# EAGLE design rc2014_spi (EAGLE 7.6.0)
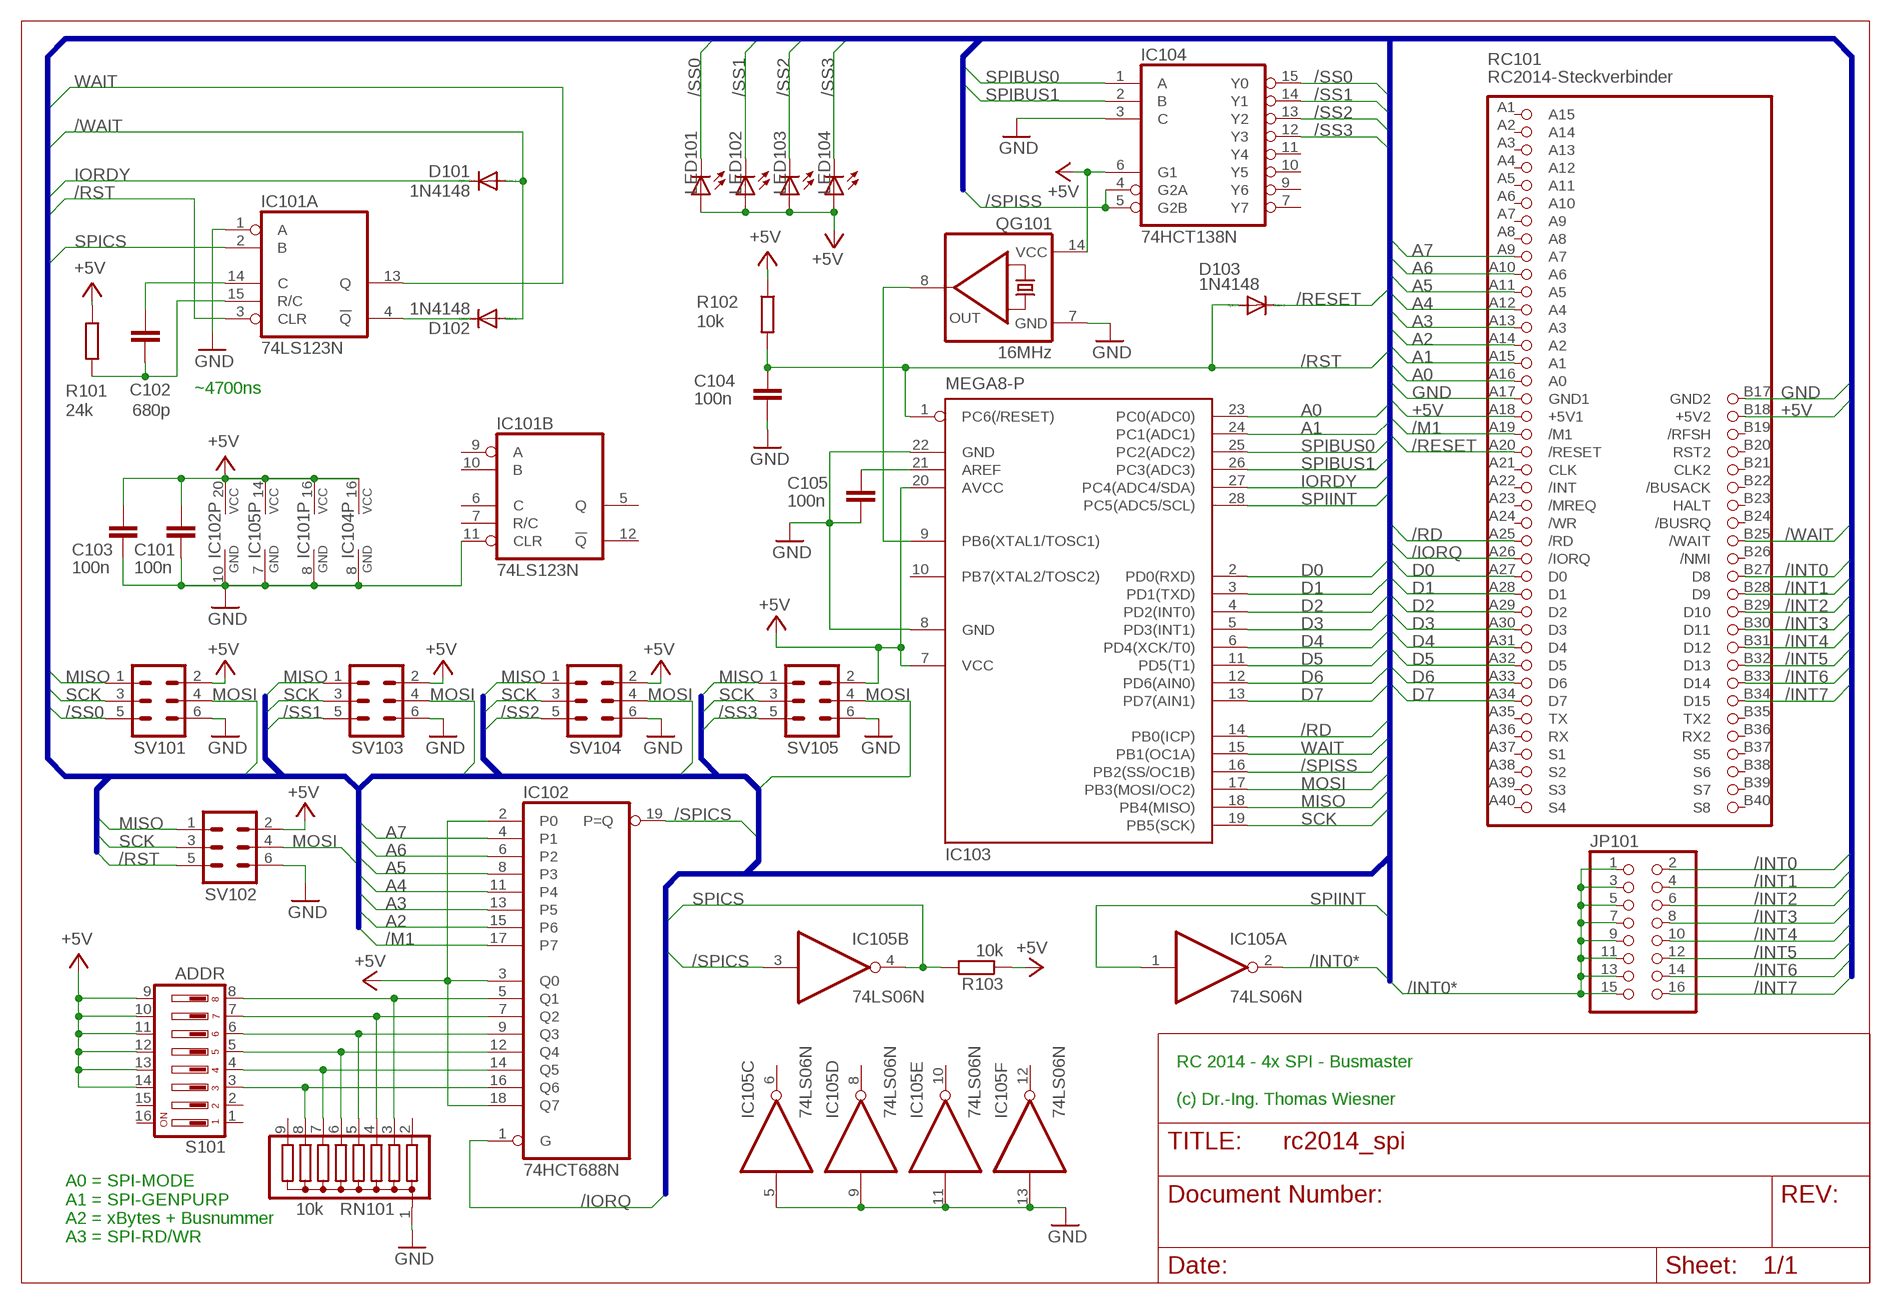
[diagram p0: schematic, sheet 1]

## Parts
C101  100n  C-EU025-025X050  [C025-025X050]
C102  680p  C-EU025-025X050  [C025-025X050]
C103  100n  C-EU025-025X050  [C025-025X050]
C104  100n  C-EU025-025X050  [C025-025X050]
C105  100n  C-EU025-025X050  [C025-025X050]
D101  1N4148  1N4148DO35-10  [DO35-10]
D102  1N4148  1N4148DO35-10  [DO35-10]
D103  1N4148  1N4148DO35-10  [DO35-10]
IC101  74LS123N  [DIL16]
IC102  74HCT688N  [DIL20]
IC103  MEGA8-P  [DIL28-3]
IC104  74HCT138N  [DIL16]
IC105  74LS06N  [DIL14]
JP101  PINHD-2X8  [2X08]
LED101  LED3MM  [LED3MM]
LED102  LED3MM  [LED3MM]
LED103  LED3MM  [LED3MM]
LED104  LED3MM  [LED3MM]
QG101  16MHz  QG5860  [DIL14S]
R101  24k  R-EU_0207/10  [0207/10]
R102  10k  R-EU_0207/10  [0207/10]
R103  10k  R-EU_0207/10  [0207/10]
RC101  RC2014-Steckverbinder  RC2014STECKER  [RC2014-STECKER]
RN101  10k  G08R  [SIL9]
S101  ADDR  DS08  [DS-08]
SV101  ML6L  [ML6L]
SV102  ML6L  [ML6L]
SV103  ML6L  [ML6L]
SV104  ML6L  [ML6L]
SV105  ML6L  [ML6L]

## Nets
+5V: C101.2 C103.2 IC101.16(P:VCC) IC102.2(P0) IC102.3(Q0) IC102.18(Q7) IC102.20(VCC) IC103.7(VCC) IC103.20(AVCC) IC104.6(G1) IC104.16(VCC) IC105.14(P:VCC) LED101.A LED102.A LED103.A LED104.A QG101.14(VCC) R101.1 R102.1 R103.1 RC101.A18(+5V1) RC101.B18(+5V2) S101.9 S101.10 S101.11 S101.12 S101.13 S101.14 SV101.2 SV102.2 SV103.2 SV104.2 SV105.2
/INT0: JP101.2 RC101.B27(D8)
/INT0*: IC105.2(A:O) JP101.1 JP101.3 JP101.5 JP101.7 JP101.9 JP101.11 JP101.13 JP101.15
/INT1: JP101.4 RC101.B28(D9)
/INT2: JP101.6 RC101.B29(D10)
/INT3: JP101.8 RC101.B30(D11)
/INT4: JP101.10 RC101.B31(D12)
/INT5: JP101.12 RC101.B32(D13)
/INT6: JP101.14 RC101.B33(D14)
/INT7: JP101.16 RC101.B34(D15)
/IORQ: IC102.1(G) RC101.A26(/IORQ)
/M1: IC102.17(P7) RC101.A19(/M1)
/RD: IC103.14(PB0(ICP)) RC101.A25(/RD)
/RESET: D103.C RC101.A20(/RESET)
/RST: C104.2 D103.A IC101.3(A:CLR) IC103.1(PC6(/RESET)) R102.2 SV102.5
/SPICS: IC102.19(P=Q) IC105.3(B:I)
/SPISS: IC103.16(PB2(SS/OC1B)) IC104.4(G2A) IC104.5(G2B)
/SS0: IC104.15(Y0) LED101.K(C) SV101.5
/SS1: IC104.14(Y1) LED102.K(C) SV103.5
/SS2: IC104.13(Y2) LED103.K(C) SV104.5
/SS3: IC104.12(Y3) LED104.K(C) SV105.5
/WAIT: D101.A D102.A RC101.B25(/WAIT)
A0: IC103.23(PC0(ADC0)) RC101.A16(A0)
A1: IC103.24(PC1(ADC1)) RC101.A15(A1)
A2: IC102.15(P6) RC101.A14(A2)
A3: IC102.13(P5) RC101.A13(A3)
A4: IC102.11(P4) RC101.A12(A4)
A5: IC102.8(P3) RC101.A11(A5)
A6: IC102.6(P2) RC101.A10(A6)
A7: IC102.4(P1) RC101.A9(A7)
D0: IC103.2(PD0(RXD)) RC101.A27(D0)
D1: IC103.3(PD1(TXD)) RC101.A28(D1)
D2: IC103.4(PD2(INT0)) RC101.A29(D2)
D3: IC103.5(PD3(INT1)) RC101.A30(D3)
D4: IC103.6(PD4(XCK/T0)) RC101.A31(D4)
D5: IC103.11(PD5(T1)) RC101.A32(D5)
D6: IC103.12(PD6(AIN0)) RC101.A33(D6)
D7: IC103.13(PD7(AIN1)) RC101.A34(D7)
GND: C101.1 C103.1 C104.1 C105.1 IC101.1(A:A) IC101.8(P:GND) IC101.11(B:CLR) IC102.10(GND) IC103.8(GND) IC103.22(GND) IC104.3(C) IC104.8(GND) IC105.5(C:I) IC105.7(P:GND) IC105.9(D:I) IC105.11(E:I) IC105.13(F:I) QG101.7(GND) RC101.A17(GND1) RC101.B17(GND2) RN101.1 SV101.6 SV102.6 SV103.6 SV104.6 SV105.6
IORDY: D101.C IC103.27(PC4(ADC4/SDA))
MISO: IC103.18(PB4(MISO)) SV101.1 SV102.1 SV103.1 SV104.1 SV105.1
MOSI: IC103.17(PB3(MOSI/OC2)) SV101.4 SV102.4 SV103.4 SV104.4 SV105.4
N$1: C102.1 IC101.15(A:R/C) R101.2
N$2: D102.C IC101.4(A:!Q)
N$3: C105.2 IC103.21(AREF)
N$4: C102.2 IC101.14(A:C)
N$6: IC102.16(Q6) RN101.8 S101.3
N$7: IC102.14(Q5) RN101.7 S101.4
N$8: IC102.12(Q4) RN101.6 S101.5
N$9: IC102.9(Q3) RN101.5 S101.6
N$10: IC102.7(Q2) RN101.4 S101.7
N$11: IC102.5(Q1) RN101.3 S101.8
QUARZ: IC103.9(PB6(XTAL1/TOSC1)) QG101.8(OUT)
SCK: IC103.19(PB5(SCK)) SV101.3 SV102.3 SV103.3 SV104.3 SV105.3
SPIBUS0: IC103.25(PC2(ADC2)) IC104.1(A)
SPIBUS1: IC103.26(PC3(ADC3)) IC104.2(B)
SPICS: IC101.2(A:B) IC105.4(B:O) R103.2
SPIINT: IC103.28(PC5(ADC5/SCL)) IC105.1(A:I)
WAIT: IC101.13(A:Q) IC103.15(PB1(OC1A))
Unconnected: IC101.5(B:Q) IC101.6(B:C) IC101.7(B:R/C) IC101.9(B:A) IC101.10(B:B) IC101.12(B:!Q) IC103.10(PB7(XTAL2/TOSC2)) IC104.7(Y7) IC104.9(Y6) IC104.10(Y5) IC104.11(Y4) IC105.6(C:O) IC105.8(D:O) IC105.10(E:O) IC105.12(F:O) RC101.A1(A15) RC101.A2(A14) RC101.A3(A13) RC101.A4(A12) RC101.A5(A11) RC101.A6(A10) RC101.A7(A9) RC101.A8 RC101.A21(CLK) RC101.A22(/INT) RC101.A23(/MREQ) RC101.A24(/WR) RC101.A35(TX) RC101.A36(RX) RC101.A37(S1) RC101.A38(S2) RC101.A39(S3) RC101.A40(S4) RC101.B19(/RFSH) RC101.B20(RST2) RC101.B21(CLK2) RC101.B22(/BUSACK) RC101.B23(HALT) RC101.B24(/BUSRQ) RC101.B26(/NMI) RC101.B35(TX2) RC101.B36(RX2) RC101.B37(S5) RC101.B38(S6) RC101.B39(S7) RC101.B40(S8) RN101.2 RN101.9 S101.1 S101.2 S101.15 S101.16

## Buses
B$1
B$2

## Notes on the sheet
- ~4700ns
- RC 2014 - 4x SPI - Busmaster
  
  (c) Dr.-Ing. Thomas Wiesner
- A0 = SPI-MODE
  A1 = SPI-GENPURP
  A2 = xBytes + Busnummer
  A3 = SPI-RD/WR

## Library data of the parts
C101-C105 = rcl:C-EU: CAPACITOR, European symbol
D101-D103 = diode:1N4148: DIODE high speed (Philips)
IC101 = 74xx-eu:74*123: Retriggerable monostable MULTIVIBRATOR
IC102 = 74xx-eu:74*688: 8-bit MAGNITUDE/IDENTITY COMPARATOR, totem pole
IC103 = atmel:MEGA8-P: MICROCONTROLLER 8 Kbytes FLASH, 1 kbytes SRAM, 512 bytes EEPROM, USART, 4-channel 10 bit ADC, 2-channel 8 bit ADC Pin compatible with Atmega48, ATMega88, ATMega168 Source: avr.lbr; OC_FARNELL: unknown; OC_NEWARK: unknown
IC104 = 74xx-eu:74*138: 3-line to 8-line DECODER/DEMULTIPLEXER
IC105 = 74xx-eu:74*06: Hex INVERTER, open collector high-voltage output
JP101 = pinhead:PINHD-2X8: PIN HEADER
LED101-LED104 = led:LED: LED OSRAM: - CHIPLED LG R971, LG N971, LY N971, LG Q971, LY Q971, LO R971, LY R971 LH N974, LH R974 LS Q976, LO Q976, LY Q976 LO Q996 - Hyper CHIPLED LW Q18S LB Q993, LB Q99A, LB R99A - SideLED LS A670, LO A670, LY A670, LG A670, LP A670 LB A673, LV A673, LT A673, LW A673 LH A674 LY A675 LS A676, LA A676, LO A676, LY A676, LW A676 LS A679, LY A679, LG A679 - Hyper Micro SIDELED® LS Y876, LA Y876, LO Y876, LY Y876 LT Y87S - SmartLED LW L88C, LW L88S LB L89C, LB L89S, LG L890 LS L89K, LO L89K, LY L89K LS L896, LA L896, LO L896, LY L896 - TOPLED LS T670, LO T670, LY T670, LG T670, LP T670 LSG T670, LSP T670, LSY T670, LOP T670, LYG T670 LG T671, LOG T671, LSG T671 LB T673, LV T673, LT T673, LW T673 LH T674 LS T676, LA T676, LO T676, LY T676, LB T676, LH T676, LSB T676, LW T676 LB T67C, LV T67C, LT T67C, LS T67K, LO T67K, LY T67K, LW E67C LS E67B, LA E67B, LO E67B, LY E67B, LB E67C, LV E67C, LT E67C LW T67C LS T679, LY T679, LG T679 LS T770, LO T770, LY T770, LG T770, LP T770 LB T773, LV T773, LT T773, LW T773 LH T774 LS E675, LA E675, LY E675, LS T675 LS T776, LA T776, LO T776, LY T776, LB T776 LHGB T686 LT T68C, LB T68C - Hyper Mini TOPLED® LB M676 - Mini TOPLED Santana® LG M470 LS M47K, LO M47K, LY M47K Source: http://www.osram.convergy.de LUXEON: - LUMILED® LXK2-PW12-R00, LXK2-PW12-S00, LXK2-PW14-U00, LXK2-PW14-V00 LXK2-PM12-R00, LXK2-PM12-S00, LXK2-PM14-U00 LXK2-PE12-Q00, LXK2-PE12-R00, LXK2-PE12-S00, LXK2-PE14-T00, LXK2-PE14-U00 LXK2-PB12-K00, LXK2-PB12-L00, LXK2-PB12-M00, LXK2-PB14-N00, LXK2-PB14-P00, LXK2-PB14-Q00 LXK2-PR12-L00, LXK2-PR12-M00, LXK2-PR14-Q00, LXK2-PR14-R00 LXK2-PD12-Q00, LXK2-PD12-R00, LXK2-PD12-S00 LXK2-PH12-R00, LXK2-PH12-S00 LXK2-PL12-P00, LXK2-PL12-Q00, LXK2-PL12-R00 Source: www.luxeon.com KINGBRIGHT: KA-3528ASYC Source: www.kingbright.com
QG101 = crystal:QG5860: CRYSTAL RESONATOR; OC_FARNELL: unknown; OC_NEWARK: unknown
R101-R103 = resistor:R-EU_: RESISTOR, European symbol
RC101 = mbc:RC2014: RC-2014-Steckverbinder Modul
RN101 = resistor-sil:G08R: SIL RESISTOR; OC_FARNELL: unknown; OC_NEWARK: unknown
S101 = switch-dil:DS08: DIL/CODE SWITCH; MPN: DS08; OC_FARNELL: unknown; OC_NEWARK: 73J0071
SV101-SV105 = con-ml:ML6L: HARTING; OC_FARNELL: unknown; OC_NEWARK: unknown

## Board
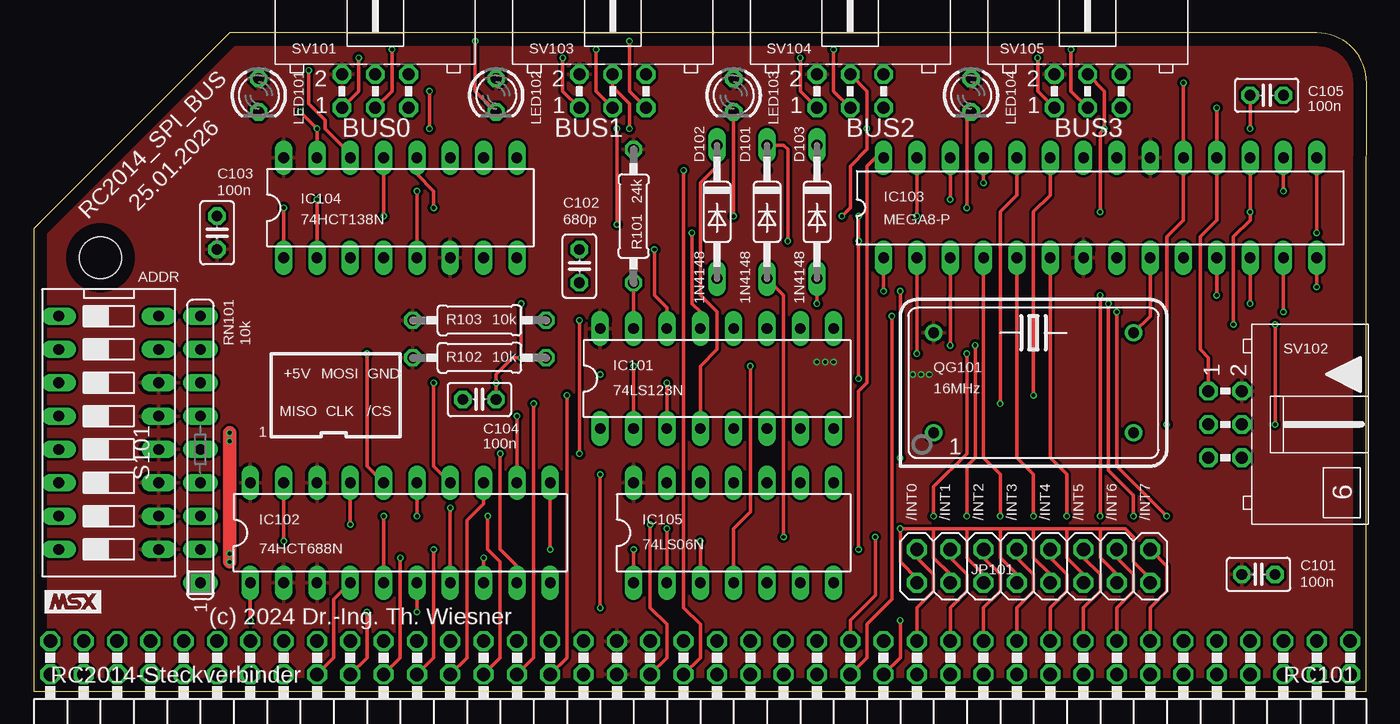
[diagram p1: board, top side]
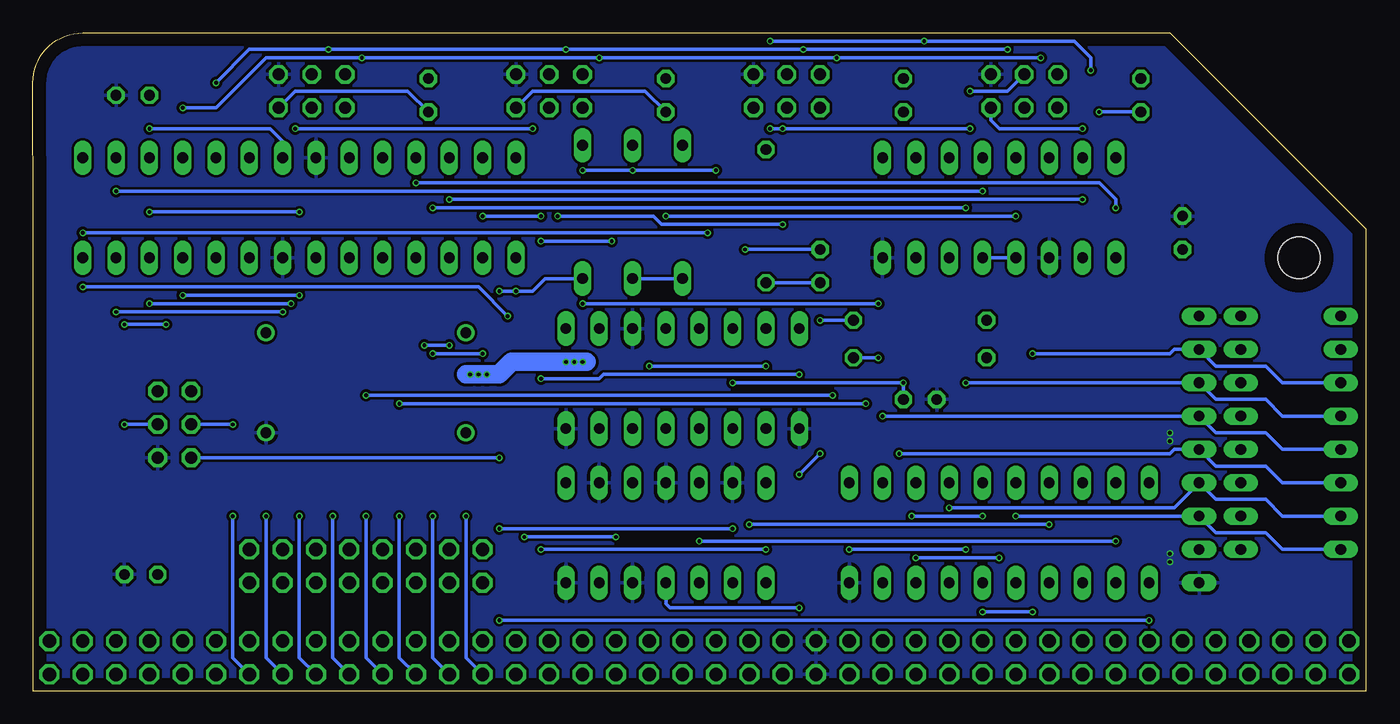
[diagram p2: board, bottom side, seen from below]

Size 101.6 x 50.16 mm. Coordinates in mm from the lower left corner, seen from the top.
Copper layers (1*16): Top 0.035mm / dielectric 1.5mm / Bottom 0.035mm
Design rules "default *": minimum track width 10mil, minimum drill 0.3mm, track to track 8mil, track to pad 4mil, pad to pad 8mil, via to via 8mil, smd to smd 8mil, copper to edge 40mil, drill to drill 8mil, minimum pad ring 10mil, minimum via ring 4mil, stop-mask expansion 4mil, vias tented up to drill 0mil, thermal gap 10mil

### Footprints (pad centres in the part's own frame; a part is rotated, then mirrored left to right if it is on the bottom)
C025-025X050 = drill 0.813 octagon: 1 -1.27,0; 2 1.27,0
DO35-10 = drill 0.813 long: A 5.08,0; C -5.08,0
DIL16 = drill 0.813 long: 1 -8.89,-3.81; 2 -6.35,-3.81; 3 -3.81,-3.81; 4 -1.27,-3.81; 5 1.27,-3.81; 6 3.81,-3.81; 7 6.35,-3.81; 8 8.89,-3.81; 9 8.89,3.81; 10 6.35,3.81; 11 3.81,3.81; 12 1.27,3.81; 13 -1.27,3.81; 14 -3.81,3.81; 15 -6.35,3.81; 16 -8.89,3.81
DIL20 = drill 0.813 long: 1 -11.43,-3.81; 2 -8.89,-3.81; 3 -6.35,-3.81; 4 -3.81,-3.81; 5 -1.27,-3.81; 6 1.27,-3.81; 7 3.81,-3.81; 8 6.35,-3.81; 9 8.89,-3.81; 10 11.43,-3.81; 11 11.43,3.81; 12 8.89,3.81; 13 6.35,3.81; 14 3.81,3.81; 15 1.27,3.81; 16 -1.27,3.81; 17 -3.81,3.81; 18 -6.35,3.81; 19 -8.89,3.81; 20 -11.43,3.81
DIL28-3 = drill 0.813 long: 1 -16.51,-3.81; 2 -13.97,-3.81; 3 -11.43,-3.81; 4 -8.89,-3.81; 5 -6.35,-3.81; 6 -3.81,-3.81; 7 -1.27,-3.81; 8 1.27,-3.81; 9 3.81,-3.81; 10 6.35,-3.81; 11 8.89,-3.81; 12 11.43,-3.81; 13 13.97,-3.81; 14 16.51,-3.81; 15 16.51,3.81; 16 13.97,3.81; 17 11.43,3.81; 18 8.89,3.81; 19 6.35,3.81; 20 3.81,3.81; 21 1.27,3.81; 22 -1.27,3.81; 23 -3.81,3.81; 24 -6.35,3.81; 25 -8.89,3.81; 26 -11.43,3.81; 27 -13.97,3.81; 28 -16.51,3.81
DIL14 = drill 0.813 long: 1 -7.62,-3.81; 2 -5.08,-3.81; 3 -2.54,-3.81; 4 0,-3.81; 5 2.54,-3.81; 6 5.08,-3.81; 7 7.62,-3.81; 8 7.62,3.81; 9 5.08,3.81; 10 2.54,3.81; 11 0,3.81; 12 -2.54,3.81; 13 -5.08,3.81; 14 -7.62,3.81
2X08 = drill 1.016 octagon: 1 -8.89,-1.27; 2 -8.89,1.27; 3 -6.35,-1.27; 4 -6.35,1.27; 5 -3.81,-1.27; 6 -3.81,1.27; 7 -1.27,-1.27; 8 -1.27,1.27; 9 1.27,-1.27; 10 1.27,1.27; 11 3.81,-1.27; 12 3.81,1.27; 13 6.35,-1.27; 14 6.35,1.27; 15 8.89,-1.27; 16 8.89,1.27
LED3MM = drill 0.813 octagon: A -1.27,0; K 1.27,0
DIL14S = drill 0.813: 1 -7.62,-3.81; 7 7.62,-3.81; 8 7.62,3.81; 14 -7.62,3.81
0207/10 = drill 0.813 octagon: 1 -5.08,0; 2 5.08,0
RC2014-STECKER = drill 1.016 octagon: A1 -49.53,1.27; A2 -46.99,1.27; A3 -44.45,1.27; A4 -41.91,1.27; A5 -39.37,1.27; A6 -36.83,1.27; A7 -34.29,1.27; A8 -31.75,1.27; A9 -29.21,1.27; A10 -26.67,1.27; A11 -24.13,1.27; A12 -21.59,1.27; A13 -19.05,1.27; A14 -16.51,1.27; A15 -13.97,1.27; A16 -11.43,1.27; A17 -8.89,1.27; A18 -6.35,1.27; A19 -3.81,1.27; A20 -1.27,1.27; A21 1.27,1.27; A22 3.81,1.27; A23 6.35,1.27; A24 8.89,1.27; A25 11.43,1.27; A26 13.97,1.27; A27 16.51,1.27; A28 19.05,1.27; A29 21.59,1.27; A30 24.13,1.27; A31 26.67,1.27; A32 29.21,1.27; A33 31.75,1.27; A34 34.29,1.27; A35 36.83,1.27; A36 39.37,1.27; A37 41.91,1.27; A38 44.45,1.27; A39 46.99,1.27; A40 49.53,1.27; B1 -49.53,3.81; B2 -46.99,3.81; B3 -44.45,3.81; B4 -41.91,3.81; B5 -39.37,3.81; B6 -36.83,3.81; B7 -34.29,3.81; B8 -31.75,3.81; B9 -29.21,3.81; B10 -26.67,3.81; B11 -24.13,3.81; B12 -21.59,3.81; B13 -19.05,3.81; B14 -16.51,3.81; B15 -13.97,3.81; B16 -11.43,3.81; B17 -8.89,3.81; B18 -6.35,3.81; B19 -3.81,3.81; B20 -1.27,3.81; B21 1.27,3.81; B22 3.81,3.81; B23 6.35,3.81; B24 8.89,3.81; B25 11.43,3.81; B26 13.97,3.81; B27 16.51,3.81; B28 19.05,3.81; B29 21.59,3.81; B30 24.13,3.81; B31 26.67,3.81; B32 29.21,3.81; B33 31.75,3.81; B34 34.29,3.81; B35 36.83,3.81; B36 39.37,3.81; B37 41.91,3.81; B38 44.45,3.81; B39 46.99,3.81; B40 49.53,3.81 | hole 3.2: -45.72,33.02
SIL9 = drill 0.813 long: 1 -10.16,0; 2 -7.62,0; 3 -5.08,0; 4 -2.54,0; 5 0,0; 6 2.54,0; 7 5.08,0; 8 7.62,0; 9 10.16,0
DS-08 = drill 0.813 long: 1 -8.89,-3.81; 2 -6.35,-3.81; 3 -3.81,-3.81; 4 -1.27,-3.81; 5 1.27,-3.81; 6 3.81,-3.81; 7 6.35,-3.81; 8 8.89,-3.81; 9 8.89,3.81; 10 6.35,3.81; 11 3.81,3.81; 12 1.27,3.81; 13 -1.27,3.81; 14 -3.81,3.81; 15 -6.35,3.81; 16 -8.89,3.81
ML6L = drill 0.914 octagon: 1 -2.54,-1.27; 2 -2.54,1.27; 3 0,-1.27; 4 0,1.27; 5 2.54,-1.27; 6 2.54,1.27

### Placement (x,y rotation side)
C101  93.34,8.89 180 top
C102  41.59,32.38 90 top
C103  13.97,34.92 270 top
C104  33.97,22.23 0 top
C105  93.98,45.4 180 top
D101  55.88,36.51 270 top
D102  52.07,36.51 270 top
D103  59.69,36.51 270 top
IC101  52.07,23.81 0 top
IC102  27.94,12.06 0 top
IC103  81.28,36.83 0 top
IC104  27.94,36.83 0 top
IC105  53.34,12.06 0 top
JP101  76.2,9.53 0 top
LED101  17.14,45.4 270 top
LED102  35.24,45.4 270 top
LED103  53.34,45.4 270 top
LED104  71.44,45.4 270 top
QG101  76.2,23.5 0 top
R101  45.72,36.2 270 top
R102  33.97,25.4 0 top
R103  33.97,28.26 0 top
RC101  50.8,0 0 top
RN101  12.7,18.41 90 top
S101  5.71,19.68 270 top
SV101  26.04,45.72 0 top
SV102  90.81,20.32 270 top
SV103  44.13,45.72 0 top
SV104  62.23,45.72 0 top
SV105  80.33,45.72 0 top

### Tracks (layer width: path | path; a pad name or v marks a point on that pad's centre or on a via)
+5V  (via drill 0.3)
  Bottom 1.422: 59.37,25.08 v59.69,25.08 v60.33,25.08 v60.96,25.08 65.09,25.08 66.04,24.13 v66.99,24.13 v67.63,24.13 v68.26,24.13 68.58,24.13
  pour Top: 0,35.24 14.92,50.16 101.6,50.16 101.6,0 0,0
/INT0
  Top 0.254: RC101.B27 67.31,6.35 68.58,7.62 68.58,8.89 67.31,10.16 JP101.2
/INT0*  (via drill 0.3)
  Top 0.254: JP101.15 85.09,8.57 83.82,9.84 83.82,11.75 83.19,12.38 81.28,12.38 | 81.28,12.38 78.74,12.38 | 78.74,12.38 76.2,12.38 | 76.2,12.38 73.66,12.38 | 73.66,12.38 71.12,12.38 | 71.12,12.38 68.58,12.38 | 68.58,12.38 v66.04,12.38 66.04,9.84 67.31,8.57 JP101.1 | JP101.3 69.85,8.89 68.58,10.16 68.58,12.38 | JP101.5 72.39,8.89 71.12,10.16 71.12,12.38 | JP101.7 74.93,8.89 73.66,10.16 73.66,12.38 | JP101.9 77.47,8.89 76.2,10.16 76.2,12.38 | JP101.11 80.01,8.89 78.74,10.16 78.74,12.38 | JP101.13 82.55,8.89 81.28,10.16 81.28,12.38 | IC105.2 v48.26,12.38
  Bottom 0.254: v48.26,12.38 v66.04,12.38
/INT1
  Top 0.254: RC101.B28 69.85,6.35 71.12,7.62 71.12,8.89 69.85,10.16 JP101.4
/INT2
  Top 0.254: RC101.B29 72.39,6.35 73.66,7.62 73.66,8.89 72.39,10.16 JP101.6
/INT3
  Top 0.254: RC101.B30 74.93,6.35 76.2,7.62 76.2,8.89 74.93,10.16 JP101.8
/INT4
  Top 0.254: RC101.B31 77.47,6.35 78.74,7.62 78.74,8.89 77.47,10.16 JP101.10
/INT5
  Top 0.254: RC101.B32 80.01,6.35 81.28,7.62 81.28,8.89 80.01,10.16 JP101.12
/INT6
  Top 0.254: RC101.B33 82.55,6.35 83.82,7.62 83.82,8.89 82.55,10.16 JP101.14
/INT7
  Top 0.254: RC101.B34 85.09,6.35 86.36,7.62 86.36,9.53 JP101.16
/IORQ  (via drill 0.3)
  Top 0.254: RC101.A26 66.04,2.54 v66.04,5.4 | v16.51,5.4 IC102.1
  Bottom 0.254: v66.04,5.4 v16.51,5.4
/M1  (via drill 0.3)
  Top 0.254: RC101.A19 48.26,2.54 48.26,5.08 46.99,6.35 v46.99,12.7 | v24.13,12.7 IC102.17
  Bottom 0.254: v46.99,12.7 v24.13,12.7
/RD  (via drill 0.3)
  Top 0.254: RC101.A25 63.5,2.54 63.5,5.08 65.41,6.99 v65.41,28.57 | v97.79,30.8 IC103.14
  Bottom 0.254: v65.41,28.57 67.63,30.8 v97.79,30.8
/RESET  (via drill 0.3)
  Top 0.254: RC101.A20 50.8,2.54 50.8,5.08 49.53,6.35 v49.53,39.69 | v59.69,39.69 D103.C
  Bottom 0.254: v49.53,39.69 v55.88,39.69 v59.69,39.69
/RST  (via drill 0.3)
  Top 0.254: v66.04,17.78 v66.04,30.48 | v64.77,30.48 IC103.1 | R102.2 v37.15,25.4 | v37.15,25.4 36.51,25.4 35.24,24.13 v35.24,23.5 C104.2 | D103.A v59.69,29.53 | v37.15,29.53 v37.15,25.4 | IC101.3 v48.26,23.5
  Bottom 0.254: SV102.5 v66.04,17.78 | v66.04,30.48 v64.77,30.48 63.5,30.48 62.55,31.43 D103.A | v59.69,29.53 v37.15,29.53 | v37.15,25.4 R102.2 | v48.26,23.5 v35.24,23.5 C104.2
/SPICS  (via drill 0.3)
  Top 0.254: IC105.3 v50.8,11.43 | v19.05,11.43 IC102.19
  Bottom 0.254: v50.8,11.43 v19.05,11.43
/SPISS  (via drill 0.3)
  Top 0.254: IC103.16 v95.25,38.1 | v29.21,38.1 IC104.5
  Bottom 0.254: v95.25,38.1 v29.21,38.1 | IC104.4 IC104.5
/SS0  (via drill 0.3)
  Top 0.254: IC104.15 v21.59,42.86 v20.32,44.13
  Bottom 0.254: LED101.K v20.32,44.13 | SV101.5 28.57,43.5 27.94,42.86 v21.59,42.86
/SS1  (via drill 0.3)
  Top 0.254: IC104.14 24.13,40.96 22.23,42.86 22.23,43.5 20.95,44.77 v20.95,47.31 | v33.66,49.53 33.66,45.72 LED102.K | SV103.5 45.4,45.72 v45.4,49.53
  Bottom 0.254: v20.95,47.31 20.95,48.26 22.23,49.53 v33.66,49.53 v45.4,49.53
/SS2  (via drill 0.3)
  Top 0.254: IC104.13 v26.67,36.2 | v53.34,36.2 LED103.K
  Bottom 0.254: v26.67,36.2 v53.34,36.2 | LED103.K 54.93,45.72 63.5,45.72 SV104.5
/SS3  (via drill 0.3)
  Top 0.254: IC104.12 29.21,39.37 30.48,38.1 v30.48,36.83 | v71.12,36.83 71.12,43.81 LED104.K
  Bottom 0.254: v30.48,36.83 v71.12,36.83 | LED104.K 73.03,45.72 81.6,45.72 SV105.5
/WAIT  (via drill 0.3)
  Top 0.254: RC101.B25 62.23,5.4 64.14,7.3 v64.14,11.75 | D101.A 57.15,30.16 v57.15,11.75
  Bottom 0.254: D102.A D101.A | v57.15,11.75 v64.14,11.75
A0  (via drill 0.3)
  Top 0.254: RC101.A16 40.64,2.54 v40.64,22.54 | v76.2,22.54 76.2,36.51 77.47,37.78 IC103.23
  Bottom 0.254: v40.64,22.54 v76.2,22.54
A1  (via drill 0.3)
  Top 0.254: RC101.A15 38.1,2.54 v38.1,21.91 | v73.66,21.91 73.66,36.51 74.93,37.78 IC103.24
  Bottom 0.254: v38.1,21.91 v73.66,21.91
A2  (via drill 0.3)
  Top 0.254: RC101.A14 35.56,2.54 35.56,9.84 34.61,10.79 v34.61,13.34 | v29.21,13.34 IC102.15
  Bottom 0.254: v34.61,13.34 v29.21,13.34
A3
  Top 0.254: RC101.A13 33.02,2.54 33.02,13.02 34.29,14.29 IC102.13
A4  (via drill 0.3)
  Top 0.254: RC101.A12 30.48,2.54 v30.48,10.79 | v39.37,10.79 IC102.11
  Bottom 0.254: v30.48,10.79 v39.37,10.79
A5  (via drill 0.3)
  Top 0.254: RC101.A11 27.94,2.54 v27.94,10.16 | v34.29,10.16 IC102.8
  Bottom 0.254: v27.94,10.16 v34.29,10.16
A6  (via drill 0.3)
  Top 0.254: RC101.A10 25.4,2.54 v25.4,6.03 | v29.21,6.03 IC102.6
  Bottom 0.254: v25.4,6.03 v29.21,6.03
A7
  Top 0.254: RC101.A9 22.86,2.54 22.86,6.99 IC102.4
D0  (via drill 0.3)
  Top 0.254: v68.58,13.34 68.58,15.56 71.12,18.1 v71.12,25.72 | v67.31,25.72 IC103.2
  Bottom 0.254: RC101.A27 68.58,2.54 v68.58,13.34 | v71.12,25.72 v67.31,25.72
D1  (via drill 0.3)
  Top 0.254: v71.12,13.34 71.12,17.14 71.75,17.78 v71.75,26.35 | v69.85,26.35 IC103.3
  Bottom 0.254: RC101.A28 71.12,2.54 v71.12,13.34 | v71.75,26.35 v69.85,26.35
D2  (via drill 0.3)
  Top 0.254: v73.66,13.34 73.66,16.51 72.39,17.78 IC103.4
  Bottom 0.254: RC101.A29 73.66,2.54 v73.66,13.34
D3  (via drill 0.3)
  Top 0.254: v76.2,13.34 76.2,16.51 74.93,17.78 IC103.5
  Bottom 0.254: RC101.A30 76.2,2.54 v76.2,13.34
D4  (via drill 0.3)
  Top 0.254: v78.74,13.34 78.74,16.51 77.47,17.78 IC103.6
  Bottom 0.254: RC101.A31 78.74,2.54 v78.74,13.34
D5  (via drill 0.3)
  Top 0.254: v81.28,13.34 v81.28,30.16 | v90.17,30.16 IC103.11
  Bottom 0.254: RC101.A32 81.28,2.54 v81.28,13.34 | v81.28,30.16 v90.17,30.16
D6  (via drill 0.3)
  Top 0.254: v83.82,13.34 83.82,14.92 81.92,16.83 v81.92,29.53 | v92.71,29.53 IC103.12
  Bottom 0.254: RC101.A33 83.82,2.54 v83.82,13.34 | v81.92,29.53 v92.71,29.53
D7  (via drill 0.3)
  Top 0.254: v86.36,13.34 82.55,17.14 v82.55,28.89 | v95.25,28.89 IC103.13
  Bottom 0.254: RC101.A34 86.36,2.54 v86.36,13.34 | v82.55,28.89 v95.25,28.89
GND  (via drill 0.3)
  Top 1.016: v14.92,19.68 v14.92,19.05 v14.92,10.48 v14.92,9.84
  pour Bottom: 0,35.24 14.92,50.16 101.6,50.16 101.6,0 0,0
IORDY  (via drill 0.3)
  Top 0.254: v62.87,23.81 v62.87,34.29 v62.87,36.2 | v67.31,36.2 IC103.27 | D101.C 57.15,41.59 57.47,41.27 v57.47,34.29
  Bottom 0.254: v43.18,24.13 58.1,24.13 58.42,23.81 v62.87,23.81 | v62.87,36.2 v67.31,36.2 | v57.47,34.29 v62.87,34.29
MISO  (via drill 0.3)
  Top 0.254: SV102.1 89.53,25.4 88.9,26.04 88.9,34.61 90.17,35.88 IC103.18 v90.17,44.45 | SV101.1 24.77,45.72 v24.77,48.26 | SV105.1 76.52,45.72 v76.52,48.26 | SV104.1 58.42,45.72 v58.42,48.26 | SV103.1 40.32,45.72 v40.32,48.26
  Bottom 0.254: v24.77,48.26 v40.32,48.26 v58.42,48.26 v76.52,48.26 83.82,48.26 87.63,44.45 v90.17,44.45
MOSI  (via drill 0.3)
  Top 0.254: IC103.17 v92.71,36.51 92.71,35.88 91.44,34.61 v91.44,27.94 | v94.61,27.94 v94.61,20.32 | v30.16,45.72 v30.16,42.86 | v45.4,42.86 45.4,44.77 44.13,46.04 SV103.4 | SV104.4 63.5,45.72 v63.5,42.86 63.5,41.27 62.23,40.01 62.23,36.83 v61.59,36.2 | v44.45,35.56 v44.45,42.86 | v81.28,36.51 81.28,42.55 v81.6,42.86 81.6,45.72 SV105.4
  Bottom 0.254: v91.44,27.94 v94.61,27.94 | v94.61,20.32 SV102.4 | SV101.4 27.3,45.72 v30.16,45.72 | v30.16,42.86 v44.45,42.86 v45.4,42.86 | v61.59,36.2 54.29,36.2 53.66,35.56 v44.45,35.56 | v81.28,36.51 v92.71,36.51 | v81.6,42.86 v63.5,42.86
N$1
  Top 0.254: IC101.15 R101.2
  Bottom 0.254: C102.1 R101.2
N$2
  Top 0.254: IC101.4 50.8,24.77 52.07,26.04 52.07,28.89 50.8,30.16 50.8,38.73 52.07,40.01 D102.C
N$3  (via drill 0.3)
  Top 0.254: v92.71,42.86 C105.2
  Bottom 0.254: IC103.21 82.55,41.91 83.5,42.86 v92.71,42.86
N$4  (via drill 0.3)
  Top 0.254: v47.31,33.66 47.31,30.16 48.26,29.21 IC101.14
  Bottom 0.254: C102.2 v47.31,33.66
N$6  (via drill 0.3)
  Top 0.254: v25.4,25.72 25.4,17.14 IC102.16
  Bottom 0.254: S101.3 6.35,23.5 7.62,24.77 11.43,24.77 RN101.8 14.61,26.04 14.92,25.72 v25.4,25.72
N$7  (via drill 0.3)
  Top 0.254: v30.48,23.5 30.48,17.14 IC102.14
  Bottom 0.254: S101.4 6.35,20.95 7.62,22.23 11.43,22.23 RN101.7 v30.48,23.5
N$8  (via drill 0.3)
  Top 0.254: v36.83,20.95 IC102.12
  Bottom 0.254: S101.5 6.35,18.41 7.62,19.68 11.43,19.68 RN101.6 v36.83,20.95
N$9  (via drill 0.3)
  Top 0.254: v35.56,18.1 35.56,10.79 36.83,9.53 IC102.9
  Bottom 0.254: S101.6 6.35,15.88 7.62,17.14 11.43,17.14 RN101.5 14.61,18.41 14.92,18.1 v35.56,18.1
N$10  (via drill 0.3)
  Top 0.254: v31.75,13.97 IC102.7
  Bottom 0.254: S101.7 6.35,13.34 7.62,14.61 11.43,14.61 RN101.4 14.61,13.97 v31.75,13.97
N$11  (via drill 0.3)
  Top 0.254: v26.67,13.34 IC102.5
  Bottom 0.254: S101.8 6.35,10.79 7.62,12.06 11.43,12.06 RN101.3 v26.67,13.34
QUARZ
  Top 0.254: IC103.9 85.09,28.57 QG101.8
SCK  (via drill 0.3)
  Top 0.254: v86.36,20.32 86.36,34.61 87.63,35.88 IC103.19 v87.63,46.35 | SV101.3 27.3,45.72 v27.3,48.9 | SV103.3 42.86,45.72 v42.86,48.9 | SV104.3 60.96,45.72 v60.96,48.9 | SV105.3 79.06,45.72 v79.06,48.9
  Bottom 0.254: v86.36,20.32 SV102.3 | v27.3,48.9 v42.86,48.9 v60.96,48.9 v79.06,48.9 85.09,48.9 v87.63,46.35
SPIBUS0  (via drill 0.3)
  Top 0.254: IC103.25 v72.39,38.73 | v19.05,36.83 IC104.1
  Bottom 0.254: v72.39,38.73 20.32,38.73 19.05,37.47 v19.05,36.83
SPIBUS1  (via drill 0.3)
  Top 0.254: v21.59,37.47 IC104.2 | v69.85,37.47 IC103.26
  Bottom 0.254: v69.85,37.47 v21.59,37.47
SPICS  (via drill 0.3)
  Top 0.254: v43.18,6.35 v43.18,16.51 | v41.59,18.1 v41.59,28.26 | IC105.4 53.34,12.38 54.61,13.65 v54.61,24.77 | IC101.2 v45.72,24.77
  Bottom 0.254: IC105.4 53.34,6.67 53.02,6.35 v43.18,6.35 | v43.18,16.51 v41.59,18.1 | v41.59,28.26 R103.2 | v45.72,24.77 v54.61,24.77
SPIINT  (via drill 0.3)
  Top 0.254: IC105.1 v45.72,10.79 | v62.87,10.79 62.87,22.86 63.5,23.5 63.5,40.01 64.14,40.64 IC103.28
  Bottom 0.254: v45.72,10.79 v62.87,10.79
WAIT  (via drill 0.3)
  Top 0.254: IC101.13 50.8,28.89 50.16,29.53 v50.16,34.92 | v97.79,34.92 IC103.15
  Bottom 0.254: v50.16,34.92 v97.79,34.92

### Text on the board
tNames: BUS0 | BUS1 | BUS2 | BUS3 | 25.01.2026 | RC2014_SPI_BUS | +5V | MOSI | GND | MISO | CLK | /CS | 1 | /INT0 | /INT1 | /INT2 | /INT3 | /INT4 | /INT5 | /INT6 | /INT7 | (c) 2024 Dr.-Ing. Th. Wiesner